# EAGLE design se7en (EAGLE 7.5.0)
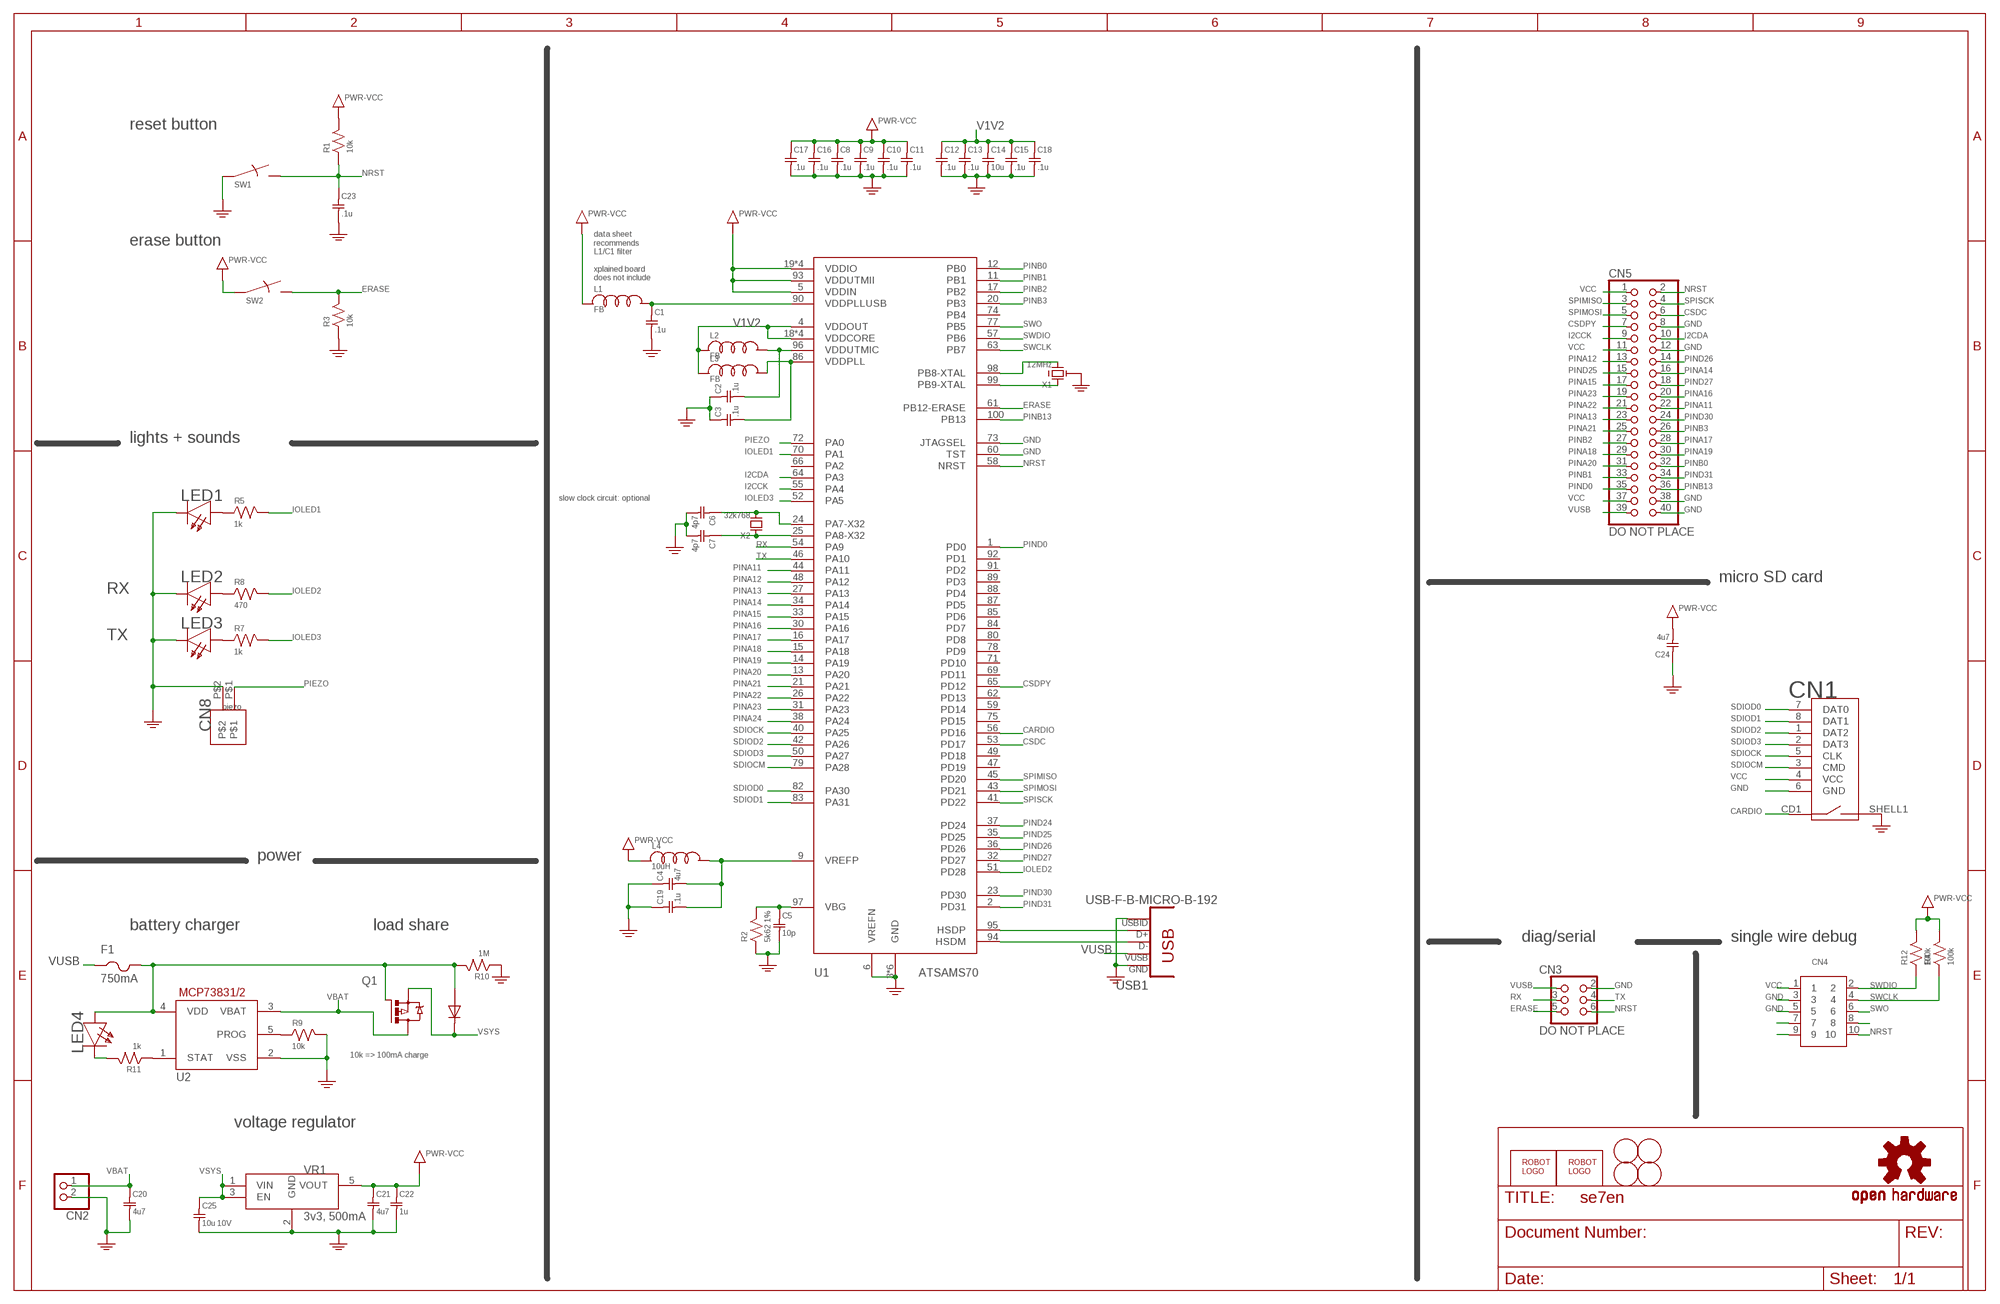
[diagram p0: schematic, sheet 1]

## Parts
C1  .1u  C-0402  [SMD0402]
C2  .1u  C-0402  [SMD0402]
C3  .1u  C-0402  [SMD0402]
C4  4u7  C0603  [SMD0603]
C5  10p  C-0402  [SMD0402]
C6  4p7  C-0402  [SMD0402]
C7  4p7  C-0402  [SMD0402]
C8  .1u  C-0402  [SMD0402]
C9  .1u  C-0402  [SMD0402]
C10  .1u  C-0402  [SMD0402]
C11  .1u  C-0402  [SMD0402]
C12  .1u  C-0402  [SMD0402]
C13  .1u  C-0402  [SMD0402]
C14  10u  C0603  [SMD0603]
C15  .1u  C-0402  [SMD0402]
C16  .1u  C-0402  [SMD0402]
C17  .1u  C-0402  [SMD0402]
C18  .1u  C-0402  [SMD0402]
C19  .1u  C-0402  [SMD0402]
C20  4u7  C0603  [SMD0603]
C21  4u7  C0603  [SMD0603]
C22  1u  C0603  [SMD0603]
C23  .1u  C-0402  [SMD0402]
C24  4u7  C0603  [SMD0603]
C25  10u 10V  C0603  [SMD0603]
CN1  MICROSD-EJECT  [MICROSD/EJECTOR]
CN2  JST_2PIN-SMT-RA  [JST-PH-2-SMT-RA]
CN3  DO NOT PLACE  HEADER-3X2-POGO  [HEADER-3X2-POGO]
CN4  DO NOT PLACE  HEADER-5X2-SMD-F  [M127-5X2-F]
CN5  DO NOT PLACE  PINHD-2X20  [2X20]
CN8  DO NOT PLACE  HEADER-1X2M254  [HEADER-1X2-THM-TIGHT]
F1  750mA  FUSE  [SMD1206]
L1  FB  L-0402  [SMD0402]
L2  FB  L-0402  [SMD0402]
L3  FB  L-0402  [SMD0402]
L4  10uH  LSMD0603  [SMD0603]
LED1  white  LED  [SMD0603D]
LED2  green  LED  [SMD0603D]
LED3  orange  LED  [SMD0603D]
LED4  RED  LED  [SMD0603D]
LOGO$1  OSHW-LOGOM  [OSHW-LOGO-M]
Q1  FDC6392S  [SOT-23-6]
R1  10k  R-0402  [SMD0402]
R2  5k62 1%  R-0402  [SMD0402]
R3  10k  R-0402  [SMD0402]
R4  100k  R-0402  [SMD0402]
R5  1k  R-0402  [SMD0402]
R7  1k  R-0402  [SMD0402]
R8  470  R-0402  [SMD0402]
R9  10k  R-0402  [SMD0402]
R10  1M  R-0402  [SMD0402]
R11  1k  R-0402  [SMD0402]
R12  100k  R-0402  [SMD0402]
SW1  SWITCHKMR211  [KMR211]
SW2  SWITCHKMR211  [KMR211]
U1  ATSAMS70  ATSAME70  [TQFP-100-14X14MM]
U2  MCP73831  [SOT-23-5]
U$1  ROBOTMAN-LOGO2  [ROBOTMAN-LOGO2]
U$2  FIDUCIAL  [FIDUCIAL_1MM]
U$3  ROBOTMAN-LOGO2  [ROBOTMAN-LOGO2]
U$4  FIDUCIAL  [FIDUCIAL_1MM]
U$5  FIDUCIAL  [FIDUCIAL_1MM]
U$6  FIDUCIAL  [FIDUCIAL_1MM]
USB1  USB-F-B-MICRO-B-192  [USB-MICRO-B-192]
VR1  3v3, 500mA  REGULATOR4-SOT23  [SOT-23-5]
X1  12MHz  RESONATORCTCE  [RESONATOR-CSTCE]
X2  32k768  XTAL32X15  [XTAL-32X15]

## Nets
CARDIO: CN1.CD1(SW1) U1.56(PD16)
CSDC: CN5.6 U1.53(PD17)
CSDPY: CN5.7 U1.65(PD12)
ERASE: CN3.5 R3.2 SW2.2 SW2.4 U1.61(PB12-ERASE)
GND: C1.2 C2.1 C3.1 C4.1 C5.2 C6.2 C7.2 C8.2 C9.2 C10.2 C11.2 C12.2 C13.2 C14.2 C15.2 C16.2 C17.2 C18.2 C19.1 C20.2 C21.2 C22.2 C23.2 C24.1 C25.2 CN1.6(GND) CN1.SHELL1(SW2) CN2.2 CN3.2 CN4.3 CN4.5 CN5.8 CN5.12 CN5.38 CN5.40 CN8.P$2 LED1.C LED2.C LED3.C R2.1 R3.1 R9.2 R10.1 SW1.1 SW1.3 U1.3(GND) U1.6(VREFN) U1.7(GND) U1.8(GND) U1.10(GND) U1.29(GND) U1.60(TST) U1.67(GND) U1.73(JTAGSEL) U2.2(VSS) USB1.P4(USBID) USB1.P5(GND) VR1.2(GND) X1.2(G) ; supply symbol labelled PWR-GND
I2CCK: CN5.9 U1.55(PA4)
I2CDA: CN5.10 U1.64(PA3)
IOLED1: R5.2 U1.70(PA1)
IOLED2: R8.2 U1.51(PD28)
IOLED3: R7.2 U1.52(PA5)
N$1: C2.2 L2.2 U1.96(VDDUTMIC)
N$2: C1.1 L1.2 U1.90(VDDPLLUSB)
N$3: C3.2 L3.2 U1.86(VDDPLL)
N$4: LED2.A R8.1
N$5: LED3.A R7.1
N$6: U1.98(PB8-XTAL) X1.3(X2)
N$7: C5.1 R2.2 U1.97(VBG)
N$8: U1.99(PB9-XTAL) X1.1(X1)
N$9: C7.1 U1.25(PA8-X32) X2.P$1
N$10: R11.1 U2.1(STAT)
N$11: C6.1 U1.24(PA7-X32) X2.P$2
N$12: LED4.C R11.2
N$16: LED1.A R5.1
N$17: R9.1 U2.5(PROG)
N$20: CN4.7
N$21: CN4.9
N$26: CN4.8
NRST: C23.1 CN3.6 CN4.10 CN5.2 R1.1 SW1.2 SW1.4 U1.58(NRST)
PIEZO: CN8.P$1 U1.72(PA0)
PINA11: CN5.22 U1.44(PA11)
PINA12: CN5.13 U1.48(PA12)
PINA13: CN5.23 U1.27(PA13)
PINA14: CN5.16 U1.34(PA14)
PINA15: CN5.17 U1.33(PA15)
PINA16: CN5.20 U1.30(PA16)
PINA17: CN5.28 U1.16(PA17)
PINA18: CN5.29 U1.15(PA18)
PINA19: CN5.30 U1.14(PA19)
PINA20: CN5.31 U1.13(PA20)
PINA21: CN5.25 U1.21(PA21)
PINA22: CN5.21 U1.26(PA22)
PINA23: CN5.19 U1.31(PA23)
PINA24: U1.38(PA24)
PINB0: CN5.32 U1.12(PB0)
PINB1: CN5.33 U1.11(PB1)
PINB2: CN5.27 U1.17(PB2)
PINB3: CN5.26 U1.20(PB3)
PINB13: CN5.36 U1.100(PB13)
PIND0: CN5.35 U1.1(PD0)
PIND24: U1.37(PD24)
PIND25: CN5.15 U1.35(PD25)
PIND26: CN5.14 U1.36(PD26)
PIND27: CN5.18 U1.32(PD27)
PIND30: CN5.24 U1.23(PD30)
PIND31: CN5.34 U1.2(PD31)
RX: CN3.3 U1.54(PA9)
SDIOCK: CN1.5(CLK) U1.40(PA25)
SDIOCM: CN1.3(CMD) U1.79(PA28)
SDIOD0: CN1.7(DAT0) U1.82(PA30)
SDIOD1: CN1.8(DAT1) U1.83(PA31)
SDIOD2: CN1.1(DAT2) U1.42(PA26)
SDIOD3: CN1.2(DAT3) U1.50(PA27)
SPIMISO: CN5.3 U1.45(PD20)
SPIMOSI: CN5.5 U1.43(PD21)
SPISCK: CN5.4 U1.41(PD22)
SWCLK: CN4.4 R4.1 U1.63(PB7)
SWDIO: CN4.2 R12.1 U1.57(PB6)
SWO: CN4.6 U1.77(PB5)
TX: CN3.4 U1.46(PA10)
USBDM: U1.94(HSDM) USB1.P2(D-)
USBDP: U1.95(HSDP) USB1.P3(D+)
V1V2: C12.1 C13.1 C14.1 C15.1 C18.1 L2.1 L3.1 U1.4(VDDOUT) U1.18(VDDCORE) U1.22(VDDCORE) U1.39(VDDCORE) U1.76(VDDCORE)
VBAT: C20.1 CN2.1 Q1.4(D) U2.3(VBAT)
VCC: C8.1 C9.1 C10.1 C11.1 C16.1 C17.1 C21.1 C22.1 C24.2 CN1.4(VCC) CN4.1 CN5.1 CN5.11 CN5.37 L1.1 L4.1 R1.2 R4.2 R12.2 SW2.1 SW2.3 U1.5(VDDIN) U1.19(VDDIO) U1.28(VDDIO) U1.68(VDDIO) U1.81(VDDIO) U1.93(VDDUTMII) VR1.5(VOUT) ; supply symbol labelled PWR-VCC
VCCA: C4.2 C19.2 L4.2 U1.9(VREFP)
VIN: F1.2 LED4.A Q1.1(A) Q1.3(G) R10.2 U2.4(VDD)
VSYS: C25.1 Q1.2(S) Q1.6(C) VR1.1(VIN) VR1.3(EN)
VUSB: CN3.1 CN5.39 F1.1 USB1.P1(VUSB)
Unconnected: U1.47(PD19) U1.49(PD18) U1.59(PD14) U1.62(PD13) U1.66(PA2) U1.69(PD11) U1.71(PD10) U1.74(PB4) U1.75(PD15) U1.78(PD9) U1.80(PD8) U1.84(PD7) U1.85(PD6) U1.87(PD5) U1.88(PD4) U1.89(PD3) U1.91(PD2) U1.92(PD1) USB1.BODY@1(BODY) USB1.BODY@2(BODY) USB1.BODY@3(BODY) USB1.BODY@4(BODY)

## Notes on the sheet
- reset button
- erase button
- data sheet
  recommends
  L1/C1 filter
  
  xplained board
  does not include
- lights + sounds
- slow clock circuit: optional
- micro SD card
- RX
- TX
- piezo
- power
- battery charger | load share
- diag/serial | single wire debug
- 10k => 100mA charge
- voltage regulator

## Library data of the parts
C1-C25 = jaw:C
CN1 = jaw:MICROSD
CN2 = jaw:JST_2PIN: JST 2-Pin Connectors of various flavors SMT-RA (S2B-PH-SM4) 4UConnector #17311 SMT (B2B-PH-SM4) THM-RA (S2B-PH) THM (B2B-PH)
CN3 = jaw:HEADER-3X2
CN4 = jaw:HEADER-5X2
CN5 = adafruit:PINHD-2X20: PIN HEADER
CN8 = jaw:HEADER-1X2
F1 = jaw:FUSE
L1-L4 = jaw:L
LED1-LED4 = jaw:LED
LOGO$1 = SparkFun-Aesthetics:OSHW-LOGO: Open Source Hardware Logo This logo indicates the piece of hardware it is found on incorporates a OSHW license and/or adheres to the definition of open source hardware found here: http://freedomdefined.org/OSHW
Q1 = jaw:FDC6392S
R1-R5 R7-R12 = jaw:R
SW1 SW2 = jaw:SWITCH
U1 = jaw:ATSAME70
U2 = jaw:MCP73831: MCP73831/2 Miniature Single-Cell, Fully Integrated Li-Ion, Li-Polymer Charge Management Controllers. Nice and small simple lipoly charge controller, with adjustable current and status output (LED) http://www.ladyada.net/library/pcb/eaglelibrary.html
U$1 U$3 = jaw:ROBOTMAN-LOGO
U$2 U$4-U$6 = adafruit:FIDUCIAL: For use by pick and place machines to calibrate the vision/machine, 1mm By microbuilder.eu
USB1 = jaw:USB-F-B: USB Female connector
VR1 = jaw:REGULATOR4
X1 = jaw:RESONATOR
X2 = jaw:XTAL

## Board
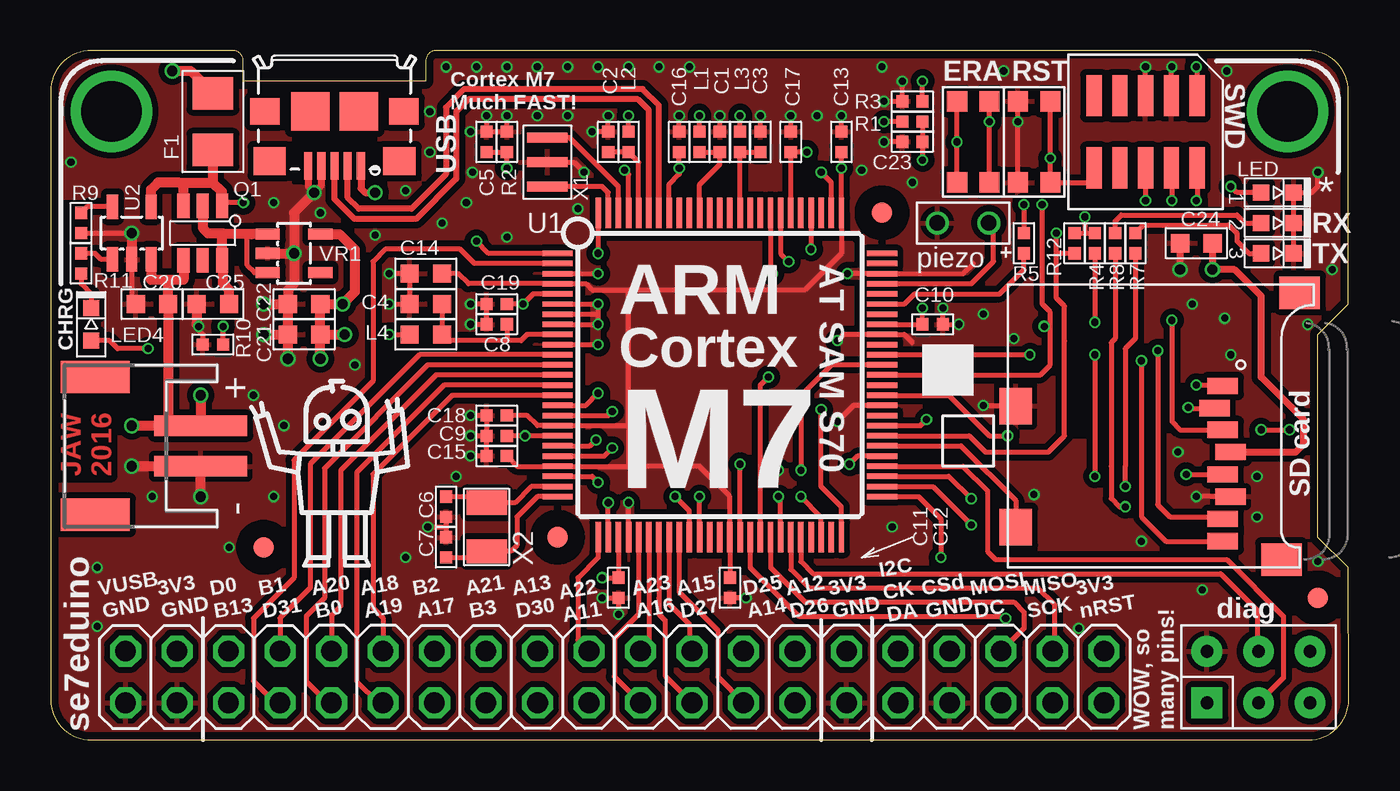
[diagram p1: board, top side]
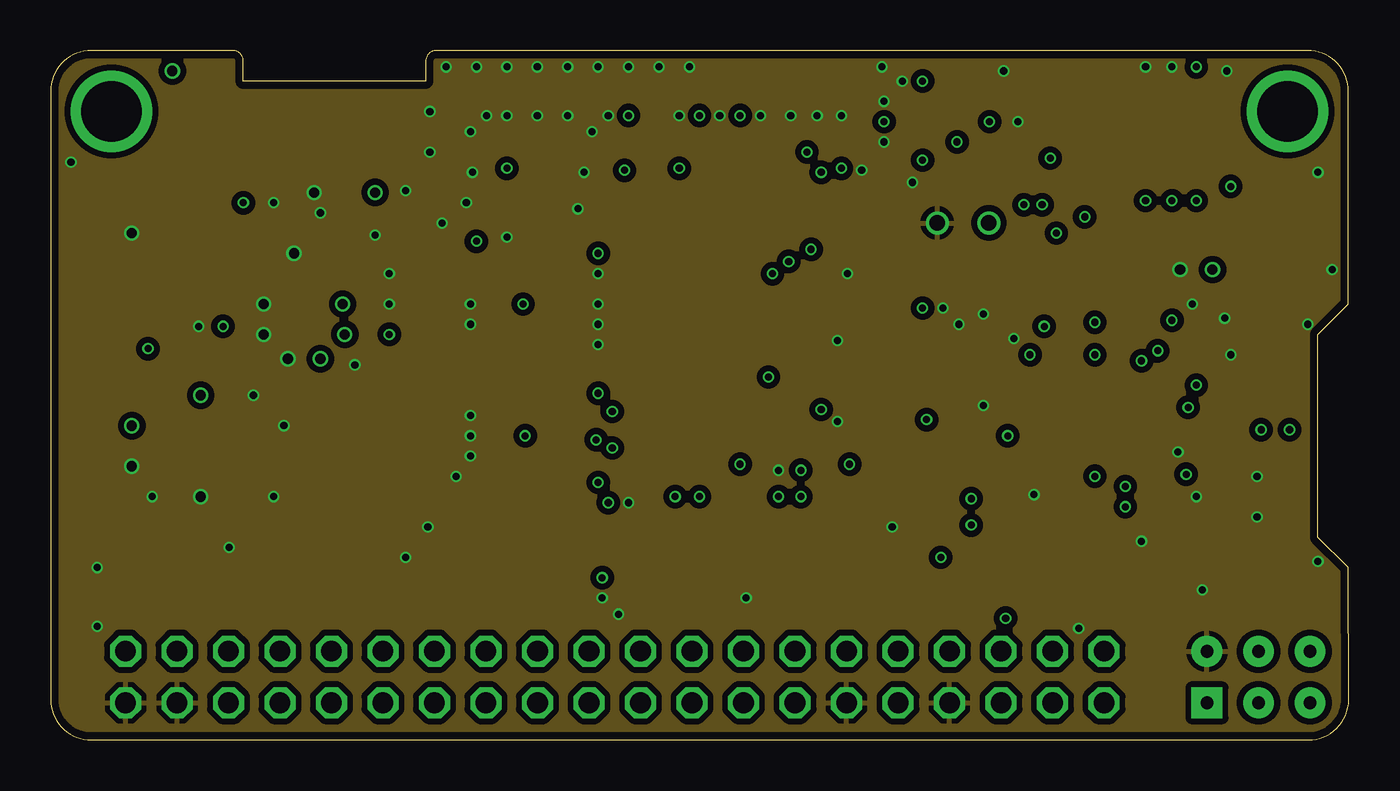
[diagram p2: board, inner layer Route2]
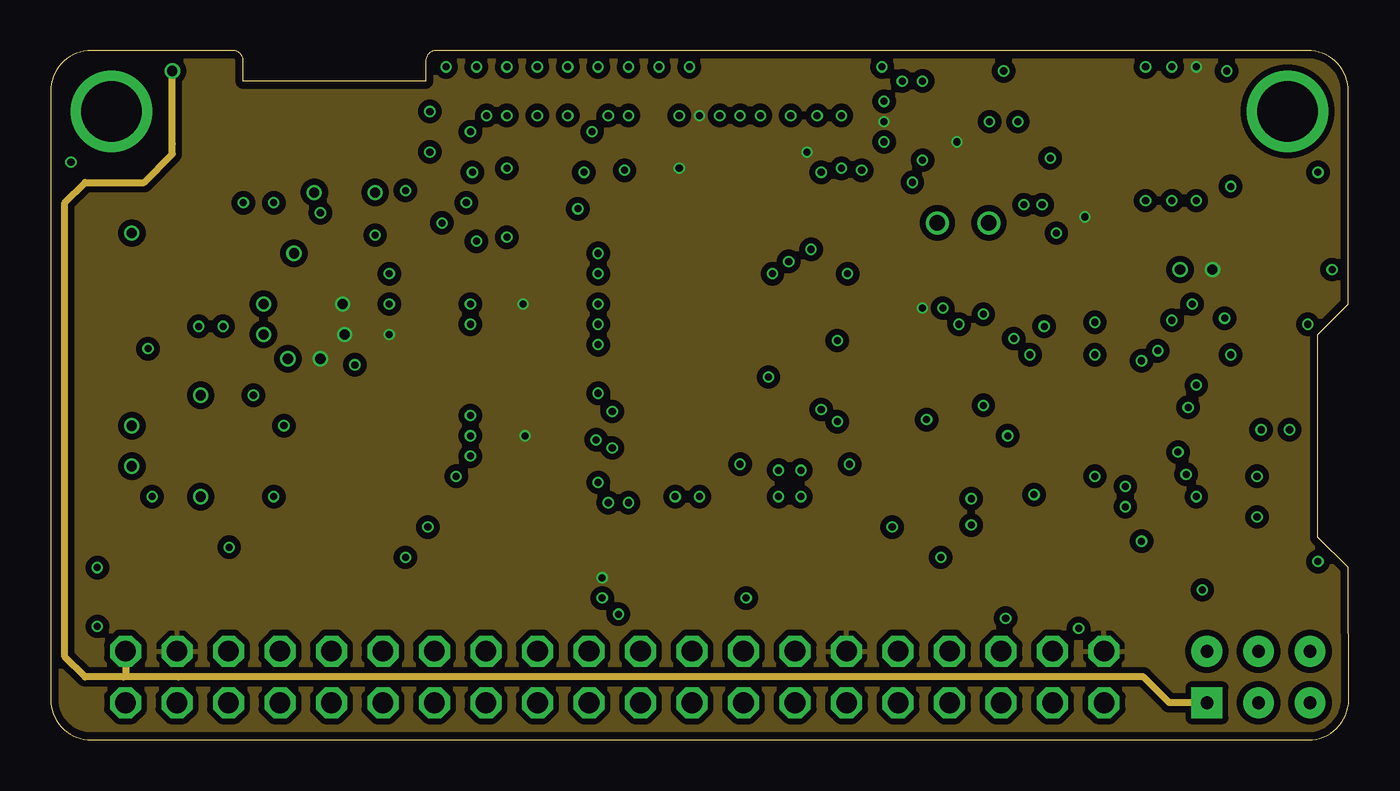
[diagram p3: board, inner layer Route15]
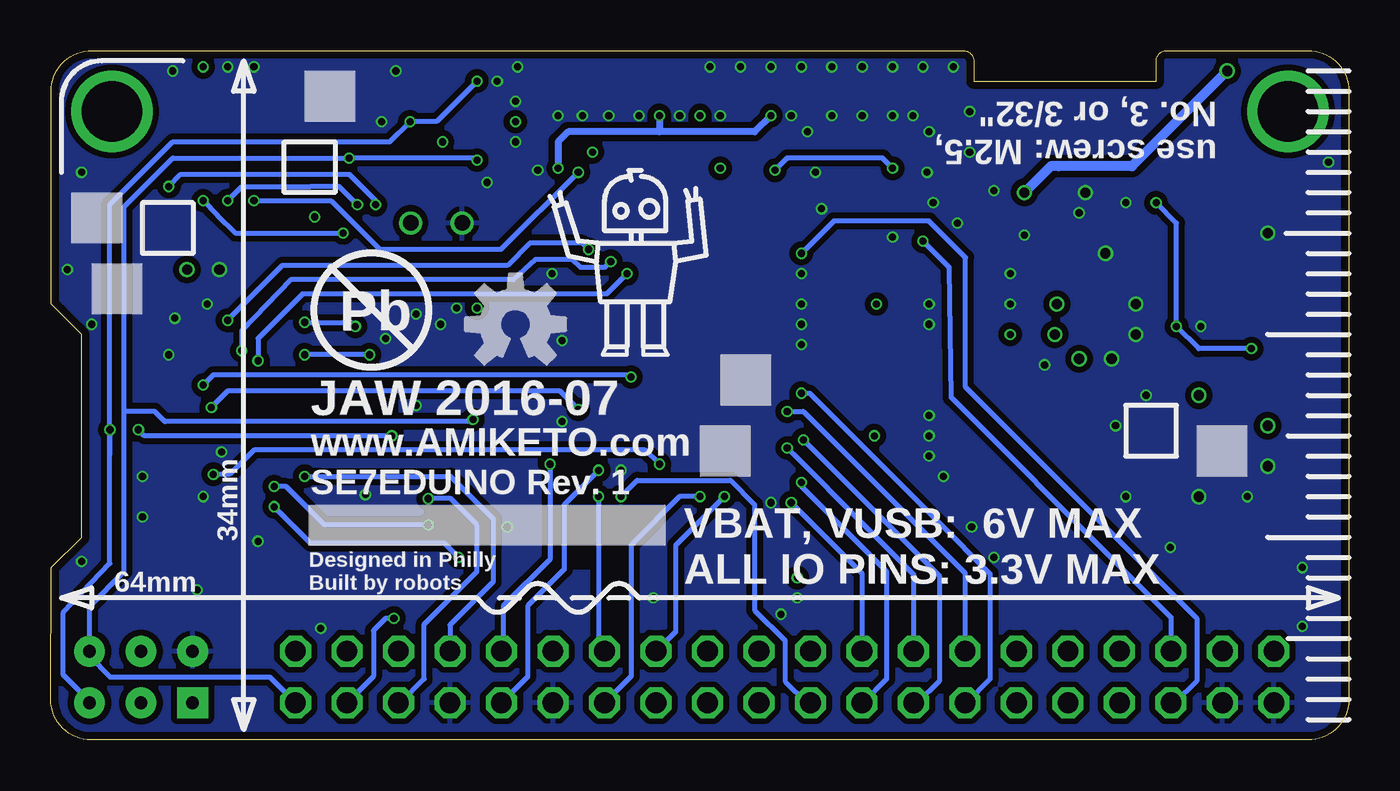
[diagram p4: board, bottom side, seen from below]

Size 64.02 x 34 mm. Coordinates in mm from the lower left corner, seen from the top.
Outline: 9,34 2,34 arc90 0,32 0,2 arc90 2,0 62.02,0 arc89 64.02,1.98 64,8.5 62.5,10 62.5,20 64,21.5 64,32 arc90 62,34 19,34 arc90 18.5,33.5 18.5,32.5 9.5,32.5 9.5,33.5 arc90 9,34
Copper layers (1*2*15*16): Top 0.035559375mm / dielectric 0.17018125mm / Route2 0.01778125mm / dielectric 47mil / Route15 0.01778125mm / dielectric 0.17018125mm / Bottom 0.035559375mm
Design rules "OSHPark-4layer *": minimum track width 5mil, minimum drill 10mil, track to track 5mil, track to pad 5mil, pad to pad 5mil, via to via 5mil, smd to smd 5mil, copper to edge 15mil, drill to drill 6mil, minimum pad ring 4mil, minimum via ring 4mil, stop-mask expansion 4mil, vias tented up to drill 0.55mm, thermal gap 10mil
tKeepout: area 0.1,28.1 to 5.9,33.9; area 58.1,28.1 to 63.9,33.9

### Footprints (pad centres in the part's own frame; a part is rotated, then mirrored left to right if it is on the bottom)
SMD0402 = smd 0.6 x 0.6: 1 -0.5,0; 2 0.5,0
SMD0603 = smd 0.9 x 0.9: 1 -0.8,0; 2 0.8,0
MICROSD/EJECTOR = smd 0.8 x 1.5: 1 -1.96,3.8; 2 -0.86,3.4; 3 0.2,3.8; 4 1.3,4.2; 5 2.4,3.8; 6 3.5,4.2; 7 4.6,3.8; 8 5.7,3.8 | smd 1.8 x 1.6: CD1 5,-6.4; SHELL1 -0.96,-6.4 | smd 1.6 x 2: SHELL2 6.6,6.7; SHELL3 -6.56,7.6
JST-PH-2-SMT-RA = smd 1 x 4.6: 1 -1,3.7; 2 1,3.7 | smd 1.6 x 3.4: NC1 3.4,-1.5; NC2 -3.4,-1.5
HEADER-3X2-POGO = drill 0.635 pad 1.524 square: 1 0,0 | drill 0.635 pad 1.524: 2 0,2.54; 3 2.54,0; 4 2.54,2.54; 5 5.08,0; 6 5.08,2.54
M127-5X2-F = smd 0.762 x 2.032: 1 -2.54,-1.778; 2 -2.54,1.778; 3 -1.27,-1.778; 4 -1.27,1.778; 5 0,-1.778; 6 0,1.778; 7 1.27,-1.778; 8 1.27,1.778; 9 2.54,-1.778; 10 2.54,1.778
2X20 = drill 1.016 octagon: 1 -24.13,-1.27; 2 -24.13,1.27; 3 -21.59,-1.27; 4 -21.59,1.27; 5 -19.05,-1.27; 6 -19.05,1.27; 7 -16.51,-1.27; 8 -16.51,1.27; 9 -13.97,-1.27; 10 -13.97,1.27; 11 -11.43,-1.27; 12 -11.43,1.27; 13 -8.89,-1.27; 14 -8.89,1.27; 15 -6.35,-1.27; 16 -6.35,1.27; 17 -3.81,-1.27; 18 -3.81,1.27; 19 -1.27,-1.27; 20 -1.27,1.27; 21 1.27,-1.27; 22 1.27,1.27; 23 3.81,-1.27; 24 3.81,1.27; 25 6.35,-1.27; 26 6.35,1.27; 27 8.89,-1.27; 28 8.89,1.27; 29 11.43,-1.27; 30 11.43,1.27; 31 13.97,-1.27; 32 13.97,1.27; 33 16.51,-1.27; 34 16.51,1.27; 35 19.05,-1.27; 36 19.05,1.27; 37 21.59,-1.27; 38 21.59,1.27; 39 24.13,-1.27; 40 24.13,1.27
HEADER-1X2-THM-TIGHT = drill 0.762: P$1 -1.27,0; P$2 1.27,0
SMD1206 = smd 1.6 x 2: 1 -1.4,0; 2 1.4,0
SMD0603D = smd 0.8 x 0.8: A 0.8,0; C -0.8,0
SOT-23-6 = smd 1.2 x 0.6: 1 -1.35,0.95; 2 -1.35,0; 3 -1.35,-0.95; 4 1.35,-0.95; 5 1.35,0; 6 1.35,0.95
KMR211 = smd 1 x 1: 1 -2,0.8; 2 -2,-0.8; 3 2,0.8; 4 2,-0.8
TQFP-100-14X14MM = smd 1.5 x 0.27: 1 -8,6; 2 -8,5.5; 3 -8,5; 4 -8,4.5; 5 -8,4; 6 -8,3.5; 7 -8,3; 8 -8,2.5; 9 -8,2; 10 -8,1.5; 11 -8,1; 12 -8,0.5; 13 -8,0; 14 -8,-0.5; 15 -8,-1; 16 -8,-1.5; 17 -8,-2; 18 -8,-2.5; 19 -8,-3; 20 -8,-3.5; 21 -8,-4; 22 -8,-4.5; 23 -8,-5; 24 -8,-5.5; 25 -8,-6; 51 8,-6; 52 8,-5.5; 53 8,-5; 54 8,-4.5; 55 8,-4; 56 8,-3.5; 57 8,-3; 58 8,-2.5; 59 8,-2; 60 8,-1.5; 61 8,-1; 62 8,-0.5; 63 8,0; 64 8,0.5; 65 8,1; 66 8,1.5; 67 8,2; 68 8,2.5; 69 8,3; 70 8,3.5; 71 8,4; 72 8,4.5; 73 8,5; 74 8,5.5; 75 8,6 | smd 0.27 x 1.5: 26 -6,-8; 27 -5.5,-8; 28 -5,-8; 29 -4.5,-8; 30 -4,-8; 31 -3.5,-8; 32 -3,-8; 33 -2.5,-8; 34 -2,-8; 35 -1.5,-8; 36 -1,-8; 37 -0.5,-8; 38 0,-8; 39 0.5,-8; 40 1,-8; 41 1.5,-8; 42 2,-8; 43 2.5,-8; 44 3,-8; 45 3.5,-8; 46 4,-8; 47 4.5,-8; 48 5,-8; 49 5.5,-8; 50 6,-8; 76 6,8; 77 5.5,8; 78 5,8; 79 4.5,8; 80 4,8; 81 3.5,8; 82 3,8; 83 2.5,8; 84 2,8; 85 1.5,8; 86 1,8; 87 0.5,8; 88 0,8; 89 -0.5,8; 90 -1,8; 91 -1.5,8; 92 -2,8; 93 -2.5,8; 94 -3,8; 95 -3.5,8; 96 -4,8; 97 -4.5,8; 98 -5,8; 99 -5.5,8; 100 -6,8
SOT-23-5 = smd 1.2 x 0.55: 1 -1.3,0.95; 2 -1.3,0; 3 -1.3,-0.95; 4 1.3,-0.95; 5 1.3,0.95
FIDUCIAL_1MM = smd 1 x 1: 1 0,0
USB-MICRO-B-192 = smd 1.6 x 1.4: BODY@1 -3.2,2.45; BODY@2 3.2,2.45 | smd 1.45 x 1.3: BODY@3 3.425,0; BODY@6 -3.425,0 | smd 1.9 x 1.9: BODY@4 1.2,0; BODY@5 -1.2,0 | smd 0.4 x 1.35: P1 -1.3,2.675; P2 -0.65,2.675; P3 0,2.675; P4 0.65,2.675; P5 1.3,2.675
RESONATOR-CSTCE = smd 0.5 x 2: 1 -1.2,0; 2 0,0; 3 1.2,0
XTAL-32X15 = smd 1.2 x 2: P$1 -1.2,0; P$2 1.2,0

### Placement (x,y rotation side)
C1  33,29.5 90 top
C2  27.5,29.5 270 top
C3  35,29.5 270 top
C4  18.5,21.5 0 top
C5  21.5,29.5 90 top
C6  19.5,11.5 270 top
C7  19.5,9.5 90 top
C8  22,21.5 180 top
C9  22,15 180 top
C10  43.5,20.5 0 top
C11  28,7.5 270 top
C12  33.5,7.5 270 top
C13  39,29.5 90 top
C14  18.5,23 180 top
C15  22,14 180 top
C16  31,29.5 90 top
C17  36.5,29.5 90 top
C18  22,16 180 top
C19  22,20.5 0 top
C20  5,21.5 180 top
C21  12.5,20 180 top
C22  12.5,21.5 180 top
C23  42.5,29.5 180 top
C24  56.5,24.5 0 top
C25  8,21.5 180 top
CN1  54,15.5 270 top
CN2  3.7,14.5 270 top
CN3  57.03,1.83 0 top
CN4  54,30 180 top
CN5  27.82,3.1 180 top
CN8  45,25.5 180 top
F1  8,30.5 270 top
L1  32,29.5 270 top
L2  28.5,29.5 270 top
L3  34,29.5 270 top
L4  18.5,20 0 top
LED1  60.5,27 180 top
LED2  60.5,25.5 180 top
LED3  60.5,24 180 top
LED4  2,20.5 270 top
LOGO$1  41.1,20.5 0 bottom
Q1  7.5,25 270 top
R1  42.5,30.5 180 top
R2  22.5,29.5 270 top
R3  42.5,31.5 0 top
R4  51.5,24.5 90 top
R5  48,24.5 270 top
R7  53.5,24.5 270 top
R8  52.5,24.5 270 top
R9  1.5,25.5 270 top
R10  8,19.5 0 top
R11  1.5,23.5 270 top
R12  50.5,24.5 90 top
SW1  48.5,29.5 90 top
SW2  45.5,29.5 90 top
U1  33,18 0 top
U2  4,25 90 top
U$1  35.2,23.4 0 bottom
U$2  62.5,7 0 top
U$3  14.1,13 0 top
U$4  10.5,9.5 0 top
U$5  41,26 0 top
U$6  25,10 0 top
USB1  14,31 180 top
VR1  12,24 0 top
X1  24.5,28.5 90 top
X2  21.5,10.5 90 top

### Tracks (layer width: path | path; a pad name or v marks a point on that pad's centre or on a via)
CARDIO
  Top 0.25: U1.56 44.9,14.5 47.6,11.8 CN1.CD1
CSDC  (via drill 0.35)
  Top 0.25: U1.53 44.3,13 v45.4,11.9
  Bottom 0.25: CN5.6 46.77,1.83 45.6,3 45.6,5.7 43,8.3 43,10.6 44.3,11.9 v45.4,11.9
CSDPY  (via drill 0.35)
  Top 0.25: U1.65 42.4,19 48.1,19 v48.3,19 | v51.5,19 v51.5,13
  Bottom 0.25: v48.3,19 v51.5,19 | v51.5,13 50.8,13 44.3,13 42.2,10.9 42.2,7.8 44.33,5.67 CN5.7
ERASE  (via drill 0.35)
  Top 0.25: SW2.2 v46.3,30.5 | v46.3,30.5 46.3,31.1 | 46.3,31.1 SW2.4 | R3.2 v43,32.5 | v46.3,30.5 46.3,31.1 | U1.61 44.3,17 46.3,15 v47.2,15 | v59.7,15.3 v61.1,15.3
  Bottom 0.25: v43,32.5 45,30.5 v46.3,30.5 47.3,29.5 58,29.5 61.1,26.4 61.1,14.1 | CN3.5 62.11,1.91 63.4,3.2 63.4,6.3 61.1,8.7 61.1,14.1 | v47.2,15 59.4,15 v59.7,15.3 | v61.1,15.3 61.1,14.1
GND  (via drill 0.35, 0.5)
  Top 0.25: v27.5,30.8 C2.1 v26.7,30 | C16.2 v31,30.8 | C1.2 v33,30.8 | C3.1 v35,30.8 | C17.2 v36.5,30.8 | C13.2 v39,30.8 | X1.2 25.8,28.5 v26.3,28 | v44,21.3 C10.2 v44.8,20.5 | v38.8,19.7 39.1,20 39.6,20 U1.67 42.1,20 42.5,19.6 | v27.2,7 C11.2 v28,6.2 | v34.3,7 C12.2 | U1.29 v28.5,11.7 | U1.3 v27,23 | U1.6 v27,21.5 27,21 | U1.10 v27,19.5 | U1.8 v27,20.5 27,21 | U1.7 27,21 | v20.7,16 C18.2 C9.2 | C9.2 v20.7,15 | v20.7,14 C15.2 C9.2 | v16.7,21.5 C4.1 C14.2 v16.7,23 | U1.60 39.6,16.5 v38.8,15.7 | v39.3,23 U1.73 45,23 45.5,23.5 | CN1.SHELL1 46.04,16.46 v46,16.5 | CN1.6 57.9,12 v56.5,12 | CN4.3 55.27,33.17 v55.3,33.2 | CN4.5 v54,33.2 | SW1.1 v47.7,30.5 SW1.3 | v42,32.5 R3.1 v41.1,31.5 | v20.7,21.5 C8.2 C19.1 v20.7,20.5 | C23.2 v41.1,29.5 | U2.2 4,21.5 C20.2 | R9.2 v4,25 | C6.2 19.5,10.5 | 19.5,10.5 C7.2 | v18.6,10.5 19.5,10.5 | v22.5,30.8 R2.1 C5.2 v21.5,30.8 | v7.3,20.4 7.3,20.2 7.5,20 R10.1 | v62.5,28 62.5,27.3 62.2,27 LED1.C LED2.C LED3.C
  Top 0.35: C24.1 v55.7,23.2 | USB1.P4 13.35,27.35 v13,27 12.7,27.3 USB1.P5
  Top 0.5: v13,27 12,26 v12,24 | C21.2 C22.2 | v11.7,18.8 C21.2 | v10.5,20 C21.2 | v4,25 U2.2 | v4,13.5 CN2.2 v7.4,12 | v10.5,21.5 C22.2 | C25.2 7.2,20.5 v7.3,20.4 | VR1.2 v12,24 | v12,24 12,22.5 11.7,22.2 C22.2
  other vias: 20.5,26.5 19.3,25.5 20.7,30 37.8,30.8 42.5,27.5 40,28.1 10,17 5,12 2.3,8.5 8.8,9.5 17.5,9 20,13 22.5,24.8 41.5,10.5 53.8,9.8 48.5,12.1 47.5,19.8 59.5,13 62,20.5 56.8,7.4 59.5,11 57.9,20.8 63.2,23.2 41,33.2 1,28.5 11,26.5 11,12 11.5,15.5 50.7,5.5 62.5,8.8 58,33 58.2,19 55.6,14.2 2.3,5.6 19.5,33.2 46,21 47,33 16,24.9 13.3,26 15,18.5 56.3,21.5 24,30.8 25.5,30.8 21,33.2 22.5,33.2 24,33.2 25.5,33.2 27,33.2 28.5,33.2 30,33.2 20.8,28 31.5,33.2 26,26.2 35.9,13.3 18.7,29 18.7,31 17.5,27.1
  pour Route2 (isolate 0.3): 0,34 64.5,34 64.5,0 0,0
  pour Bottom (isolate 0.3): 0,34 64.5,34 64.5,0 0,0
  pour Top (isolate 0.3, rank 2): 0,34 64.5,34 64.5,0 0,0
I2CCK  (via drill 0.35)
  Top 0.25: U1.55 39.8,14 v39.4,13.6
  Bottom 0.25: v39.4,13.6 39.4,8.9 41.7,6.6 41.7,4.46 CN5.9
I2CDA  (via drill 0.35)
  Top 0.25: U1.64 38.5,18.5 37,17 v37,13.3
  Bottom 0.25: v37,13.3 38.7,11.6 38.7,8.4 40.5,6.6 40.5,3.12 CN5.10
IOLED1
  Top 0.25: U1.70 42.1,21.5 42.6,22 46.8,22 48,23.2 R5.2
IOLED2  (via drill 0.35)
  Top 0.25: U1.51 42.8,12 43.9,10.9 v43.9,9 | R8.2 52.5,19.8 52.3,19.6 52.3,13.5 52.3,11.9 52.7,11.5 v53,11.5
  Bottom 0.25: v43.9,9 44.6,9.7 50.2,9.7 51.2,9.7 v53,11.5
IOLED3  (via drill 0.35)
  Top 0.25: U1.52 43.5,12.5 v45.4,10.6 | R7.2 53.5,19.8 53,19.3 53,13.5 v53,12.5
  Bottom 0.25: v45.4,10.6 50.5,10.6 52.4,12.5 v53,12.5
N$1
  Top 0.25: U1.96 29,28.5 L2.2 28,29 C2.2
N$2
  Top 0.25: U1.90 32,27.4 33,28.4 C1.1 L1.2
N$3
  Top 0.25: U1.86 L3.2 C3.2
N$4
  Top 0.25: R8.1 52.5,25.6 52.8,25.9 58.5,25.9 58.9,25.5 LED2.A
N$5
  Top 0.25: R7.1 53.9,25.4 58.1,25.4 58.5,25 58.5,24.6 59.1,24 LED3.A
N$6
  Top 0.25: U1.98 28,27.3 25.6,29.7 X1.3
N$7  (via drill 0.35)
  Top 0.25: U1.97 28.5,27.9 v28.3,28.1 | C5.1 R2.2 v22.5,28.2
  Bottom 0.25: v22.5,28.2 23,28.7 27.7,28.7 v28.3,28.1
N$8
  Top 0.25: U1.99 27.5,27 27.2,27.3 26.5,27.3 25.6,27.3 X1.1
N$9
  Top 0.25: U1.25 24,12 23,11 23,9.6 22.7,9.3 X2.P$1 21.2,9 C7.1
N$10
  Top 0.25: U2.1 2.5,23.7 2.2,24 R11.1
N$11
  Top 0.25: U1.24 23.7,12.5 22.9,11.7 X2.P$2 21.2,12 C6.1
N$12
  Top 0.25: R11.2 1.5,22.5 2,22 LED4.C
N$13  (via drill 3)
  other vias: 3,31
N$14  (via drill 3)
  other vias: 61,31
N$15
  cutout Top: 12,27.5 12,30 16,30 16,27.5
N$16  (via drill 0.35)
  Top 0.25: LED1.A 59.9,27 59.3,27 58.5,27 v58.2,27.3 | v48,26.4 48,25.9 R5.1
  Bottom 0.25: v58.2,27.3 57.6,27.9 49.3,27.9 48,26.6 v48,26.4
N$17
  Top 0.25: U2.5 1.8,26.3 R9.1
N$18
  cutout Top: 24.1,21.8 24.1,19.7 26.5,19.7 26.5,21.8
N$19
  cutout Top: 53.5,32.5 53.5,31 56,31 56,32.5
N$22
  cutout Top: -0.1,26.5 -0.1,18.9 1.5,18.9 1.5,26.5
N$23
  cutout Top: 50,15.5 50,15 51.5,15 51.5,15.5
N$24
  cutout Bottom: 47,17 47,16 48,16 48,17
N$25
  cutout Bottom: 35.5,9.5 35.5,8.5 38.5,8.5 38.5,9.5
NRST  (via drill 0.35)
  Top 0.25: SW1.4 v49.3,28.7 SW1.2 51.5,27.5 51.5,28.26 CN4.10 | U1.58 42.9,15.5 v43.2,15.8 | R1.1 C23.1 v43,28.6
  Bottom 0.25: 60.4,16.2 60.4,15.6 60.4,8.3 62.11,6.59 CN3.6 62.11,4.11 61.1,3.1 53.22,3.1 CN5.2 | 60.4,16.2 60.4,26.3 58,28.7 v49.3,28.7 43.1,28.7 v43,28.6 | v43.2,15.8 43.3,15.7 58.4,15.7 58.9,16.2 60.4,16.2
PIEZO
  Top 0.25: U1.72 45.4,22.5 46.5,23.6 46.5,25.27 CN8.P$1
PINA11  (via drill 0.35)
  Top 0.25: U1.44 36,11.9 v35.9,12
  Bottom 0.25: v35.9,12 35.1,12.8 30.5,12.8 29.3,11.6 29.3,6.4 27.8,4.9 27.8,2.9 26.73,1.83 CN5.22
PINA12  (via drill 0.35)
  Top 0.25: v37,12 38,11 U1.48
  Bottom 0.25: v37,12 37,4.66 CN5.13
PINA13  (via drill 0.35)
  Top 0.25: U1.27 v27.5,11.7
  Bottom 0.25: v27.5,11.7 24.01,8.21 CN5.23
PINA14
  Top 0.25: U1.34 31,8.1 31,7.3 32.9,5.4 32.9,3.1 CN5.16
PINA15
  Top 0.25: U1.33 30.5,7.5 30.5,6.7 31.5,5.7 31.5,4.5 CN5.17
PINA16
  Top 0.25: U1.30 29,6.2 27.8,5 27.8,3.12 CN5.20
PINA17  (via drill 0.35)
  Top 0.25: U1.16 26.4,16.5 v27,17.1
  Bottom 0.25: v27,17.1 26.6,17.1 20.3,10.8 17.7,8.2 17.7,3 18.87,1.83 CN5.28
PINA18
  Top 0.25: U1.15 19.8,17 15.9,13.1 15.9,6.5 16.39,6.01 CN5.29
PINA19
  Top 0.25: U1.14 19.4,17.5 15.1,13.2 15.1,2.9 16.17,1.83 CN5.30
PINA20
  Top 0.25: U1.13 19,18 14.3,13.3 14.3,6.6 13.85,6.15 CN5.31
PINA21  (via drill 0.35)
  Top 0.25: U1.21 27.3,14 v27.7,14.4
  Bottom 0.25: v27.7,14.4 27.4,14.1 24,10.7 21.47,8.17 CN5.25
PINA22
  Top 0.25: U1.26 27,9 26,8 26,4.92 CN5.21
PINA23
  Top 0.25: U1.31 29.5,6.5 29.5,4.78 CN5.19
PINB0
  Top 0.25: U1.12 18.6,18.5 13.5,13.4 13.5,7 12.6,6.1 12.6,2.9 13.67,1.83 CN5.32
PINB1
  Top 0.25: U1.11 18.2,19 12.8,13.6 12.8,7.5 11.31,6.01 CN5.33
PINB2  (via drill 0.35)
  Top 0.25: U1.17 27.5,16 v27.7,16.2
  Bottom 0.25: v27.7,16.2 26.9,16.2 21.6,10.9 18.93,8.23 CN5.27
PINB3  (via drill 0.35)
  Top 0.25: U1.20 26.6,14.5 v26.9,14.8
  Bottom 0.25: v26.9,14.8 22.7,10.6 20.2,8.1 20.2,2.9 21.27,1.83 CN5.26
PINB13  (via drill 0.35)
  Top 0.25: U1.100 v27,24
  Bottom 0.25: v27,24 25.4,25.6 20.7,25.6 18.9,23.8 18.9,17.4 7.5,6 7.5,2.9 8.57,1.83 CN5.36
PIND0  (via drill 0.35)
  Top 0.25: U1.1 21.6,24 v21,24.6
  Bottom 0.25: v21,24.6 19.7,23.3 19.6,16.88 11.21,8.49 8.77,6.05 CN5.35
PIND25  (via drill 0.35)
  Top 0.25: U1.35 31.5,11.3 v30.8,12
  Bottom 0.25: v30.8,12 33.2,9.6 33.2,6.3 33.2,5.34 CN5.15
PIND26  (via drill 0.35)
  Top 0.25: U1.36 v32,12
  Bottom 0.25: v32,12 33,12 35.4,9.6 35.4,5.4 35.4,3.14 CN5.14
PIND27
  Top 0.25: U1.32 30,7 30,6.2 30.3,5.9 30.3,3.16 CN5.18
PIND30  (via drill 0.35)
  Top 0.25: U1.23 26.7,13 v27,12.7
  Bottom 0.25: CN5.24 23.97,1.83 22.8,3 22.8,8.3 27,12.5 v27,12.7
PIND31
  Top 0.25: U1.2 20.9,23.5 20.2,24.2 16.5,24.2 15.9,23.6 15.9,17.7 12,13.8 12,8 10,6 10,2.9 11.07,1.83 CN5.34
RX
  Top 0.25: U1.54 45,13.5 46.2,12.3 46.2,9.3 46.6,8.9 58,8.9 60.8,6.1 60.8,3.06 CN3.3
SDIOCK  (via drill 0.35)
  Top 0.25: U1.40 v34,13.6 | v56,13.1 CN1.5
  Bottom 0.25: 55.9,13 v56,13.1 55.2,13.1 54,14.3 34.7,14.3 v34,13.6
SDIOCM  (via drill 0.35)
  Top 0.25: U1.79 v37.5,24.2 | v55.3,20.7 55.3,15.7 55.7,15.3 CN1.3
  Bottom 0.25: v37.5,24.2 37.8,24.5 40.4,24.5 41.5,23.4 52.6,23.4 v55.3,20.7
SDIOD0  (via drill 0.35)
  Top 0.25: U1.82 36,24 v36.4,23.6 | v54.6,19.2 54.6,11.6 55.2,11 57.5,11 CN1.7
  Bottom 0.25: v36.4,23.6 36.7,23.3 37.9,23.3 38.3,23.7 40.1,23.7 41.2,22.7 52.2,22.7 54.6,20.2 v54.6,19.2
SDIOD1  (via drill 0.35)
  Top 0.25: U1.83 35.5,23.1 v35.6,23 | v53.8,18.7 53.8,11 55,9.8 CN1.8
  Bottom 0.25: v35.6,23 36.6,22 51.6,22 53.8,19.8 v53.8,18.7
SDIOD2  (via drill 0.35)
  Top 0.25: U1.42 35,17.5 v35.4,17.9 | v56.5,17.5 57.56,17.5 CN1.1
  Top 0.35: 57.4,17.66 CN1.1
  Bottom 0.25: v35.4,17.9 35.5,18 56,18 v56.5,17.5
SDIOD3  (via drill 0.35)
  Top 0.25: v56.1,16.4 56.14,16.36 CN1.2 | U1.50 39,11.5 38,12.5 v38,16.3
  Bottom 0.25: v38,16.3 38.9,17.2 55.3,17.2 v56.1,16.4
SPIMISO
  Top 0.25: U1.45 36.5,8.4 37.4,7.5 48.7,7.5 49.5,6.7 49.5,4.46 CN5.3
SPIMOSI
  Top 0.25: U1.43 35.5,8.5 37.2,6.8 47.5,6.8 48,6.3 48,5.5 CN5.5 46.9,4.4
SPISCK  (via drill 0.35)
  Top 0.25: U1.41 34.5,8.5 36.9,6.1 47,6.1 v47.1,6
  Bottom 0.25: v47.1,6 47.5,6 48.1,5.4 48.1,3.14 CN5.4
SWCLK  (via drill 0.35)
  Top 0.25: CN4.4 55.3,28.19 v55.3,26.6 | U1.63 48.8,18 49.3,18.5 49.3,20.4 | 49.3,20.4 49.3,21.1 48.9,21.5 48.9,26.2 v48.9,26.4 | v49,20.4 49.3,20.4 | R4.1 51.5,21.1 v51.5,20.6
  Bottom 0.25: v55.3,26.6 54.6,27.3 51.2,27.3 49.8,27.3 v48.9,26.4 | v51.5,20.6 49.2,20.6 v49,20.4
SWDIO  (via drill 0.35)
  Top 0.25: CN4.2 56.54,26.64 v56.5,26.6 | U1.57 45.3,15 46.1,14.2 49.2,14.2 50,15 50,19.7 50,21.4 49.6,21.8 49.6,24 | 49.6,24 v49.6,25 | R12.1 49.6,24
  Bottom 0.25: v56.5,26.6 55.8,25.9 54.9,25 v49.6,25
SWO  (via drill 0.35)
  Top 0.25: CN4.6 v54,26.6 | U1.77 38.5,27.5 v38,28
  Bottom 0.25: v54,26.6 50.2,26.6 47.8,24.2 41.8,24.2 v38,28
TX
  Top 0.25: U1.46 37,8.8 37.6,8.2 57.7,8.2 59.5,6.4 59.5,4.44 CN3.4
USBDM
  Top 0.3: U1.94 30,31.3 29.2,32.1 20.4,32.1 19.5,31.2 19.5,27.9 17.8,26.2 15.2,26.2 14.65,26.75 USB1.P2 14.6,28.27
USBDP
  Top 0.3: U1.95 29.5,31.06 28.96,31.6 20.6,31.6 20,31 20,27.68 18.02,25.7 14.98,25.7 14,26.68 USB1.P3
V1V2  (via drill 0.35)
  Top 0.25: C12.1 U1.39 33.5,12 32,13.5 28.5,13.5 | C15.1 23,13.5 U1.22 28.5,13.5 | C18.1 23.5,16 24,15.5 U1.18 28.5,15.5 | 28.5,22.2 26.7,22.2 26.4,22.5 U1.4 20.6,22.5 20.1,23 C14.1 | L2.1 v28.5,30.8 | L3.1 v34,30.8 | 28.5,15.5 28.5,22.2 | 28.5,15.5 28.5,13.5 | 28.5,22.2 37.2,22.2 39,24 U1.76 v39,28.2 C13.1
  Bottom 0.35: v28.5,30.8 29.3,30 L3.1 | L3.1 38.5,30 39,29.5 v39,28.2 | v34,30.8 L3.1
  pour Top (isolate 0.3): 26.5,24.5 39.5,24.5 39.5,11.5 26.5,11.5
VBAT  (via drill 0.5)
  Top 0.5: Q1.4 6.55,22.7 5.8,22.7 | U2.3 4.95,22.7 5.8,22.7 | 5.8,22.7 C20.1 5.8,15.5 | 5.8,15.5 6.8,15.5 | 6.8,15.5 CN2.1 v7.4,17 | v4,15.5 5.8,15.5 | 5.8,15.5 6.8,15.5
VCC  (via drill 0.35, 0.5)
  Top 0.25: U1.93 30.5,27.4 31,27.9 v31,28.2 C16.1 | U1.81 C17.1 v37.3,29 | U1.68 C10.1 v43,21.3 | U1.28 C11.1 v27.2,8 | U1.19 v23.4,15 C9.1 | U1.5 23.8,22 v23.3,21.5 C8.1 | v16.7,20 L4.1 | CN4.1 56.54,33.16 v56.5,33.2 | SW2.1 v44.7,29.5 SW2.3 | R1.2 v41.1,30.5 | L1.1 v32,30.8 | R12.2 51,25 | 51,25 R4.2 | v51,25.8 51,25
  Top 0.35: C24.2 57.3,24 v57.3,23.2 58.4,23.2 59.7,21.9 59.7,17.9 61.8,15.8 61.8,14.6 61.4,14.2 CN1.4
  Top 0.5: VR1.5 14.25,24.95 15,24.2 15,22.1 v14.4,21.5 C22.1 C21.1 | C21.1 v14.5,20 | v13.3,18.8 C21.1
  pour Route15 (isolate 0.3): 0,34 64.5,34 64.5,0 0,0
VCCA
  Top 0.25: U1.9 23.5,20 23.2,19.7 22.5,19.7 | 22.5,19.7 19.6,19.7 L4.2 C4.2 | C19.2 22.5,19.7
VIN  (via drill 0.35)
  Top 0.25: R10.2 v8.5,20.4 | v9.5,26.5 8.5,26.5 Q1.1 | v4.8,19.3 3.3,19.3 2.9,19.7 LED4.A
  Top 0.5: Q1.1 8.45,27.05 8,27.5 | 8,27.5 6.3,27.5 6.1,27.5 | 6.1,27.5 5.3,27.5 4.95,27.15 U2.4 | Q1.3 6.55,27.45 6.1,27.5 | F1.2 8,27.5
  Bottom 0.25: v9.5,26.5 8.5,25.5 v8.5,20.4 7.4,19.3 v4.8,19.3
VSYS
  Top 0.25: VR1.3 10.05,23.05 9.7,23.4 9.7,24.85 9.9,24.95
  Top 0.5: Q1.2 7.5,25.25 7.75,25 8.5,25 | 8.5,25 8.45,24.95 8.45,23.95 Q1.6 8.5,23.6 8.5,22.5 8.8,22.2 C25.1 | VR1.1 9.9,24.95 8.55,24.95 8.5,25
VUSB  (via drill 0.5)
  Top 0.35: USB1.P1 15.3,27.2 15.5,27 v16,27
  Top 0.5: v6,33 6.9,33 F1.1
  Route15 0.35: CN3.1 55.17,1.83 53.9,3.1 6.3,3.1 3.6,3.1 | 3.6,3.1 1.7,3.1 0.7,4.1 0.7,26.5 1.7,27.5 4.6,27.5 6,28.9 6,29.4 v6,33 | CN5.39 3.69,3.19 3.6,3.1
  Bottom 0.5: v6,33 10.7,28.3 14.3,28.3 14.7,28.3 v16,27

### Text on the board
Top: JAW / 2016
tPlace: ERA | RST | SWD | USB | Cortex M7 / Much FAST! | * | RX | + | AT SAM S70 | piezo | TX | ARM | CHRG | Cortex | M7 | SD card | VUSB / GND | 3V3 / GND | D0 / B13 | B1 / D31 | A20 / B0 | A18 / A19 | B2 / A17 | A21 / B3 | A13 / D30 | A22 / A11 | A23 / A16 | A15 / D27 | D25 / A14 | A12 / D26 | 3V3 / GND | I2C / CK / DA | CSd / GND | MOSI / DC | MISO / SCK | 3V3 / nRST | diag | WOW, so / many pins! | se7eduino
bPlace: use screw: M2.5, / No. 3, or 3/32" | Pb | JAW 2016-07 | www.AMIKETO.com | SE7EDUINO Rev. 1 | 34mm | VBAT, VUSB: 6V MAX / ALL IO PINS: 3.3V MAX | Designed in Philly / Built by robots | 64mm
tNames: LED | 1 | 2 | 3
tValues: L